# EAGLE schematic OEPS_V2 (EAGLE 9.5.2)
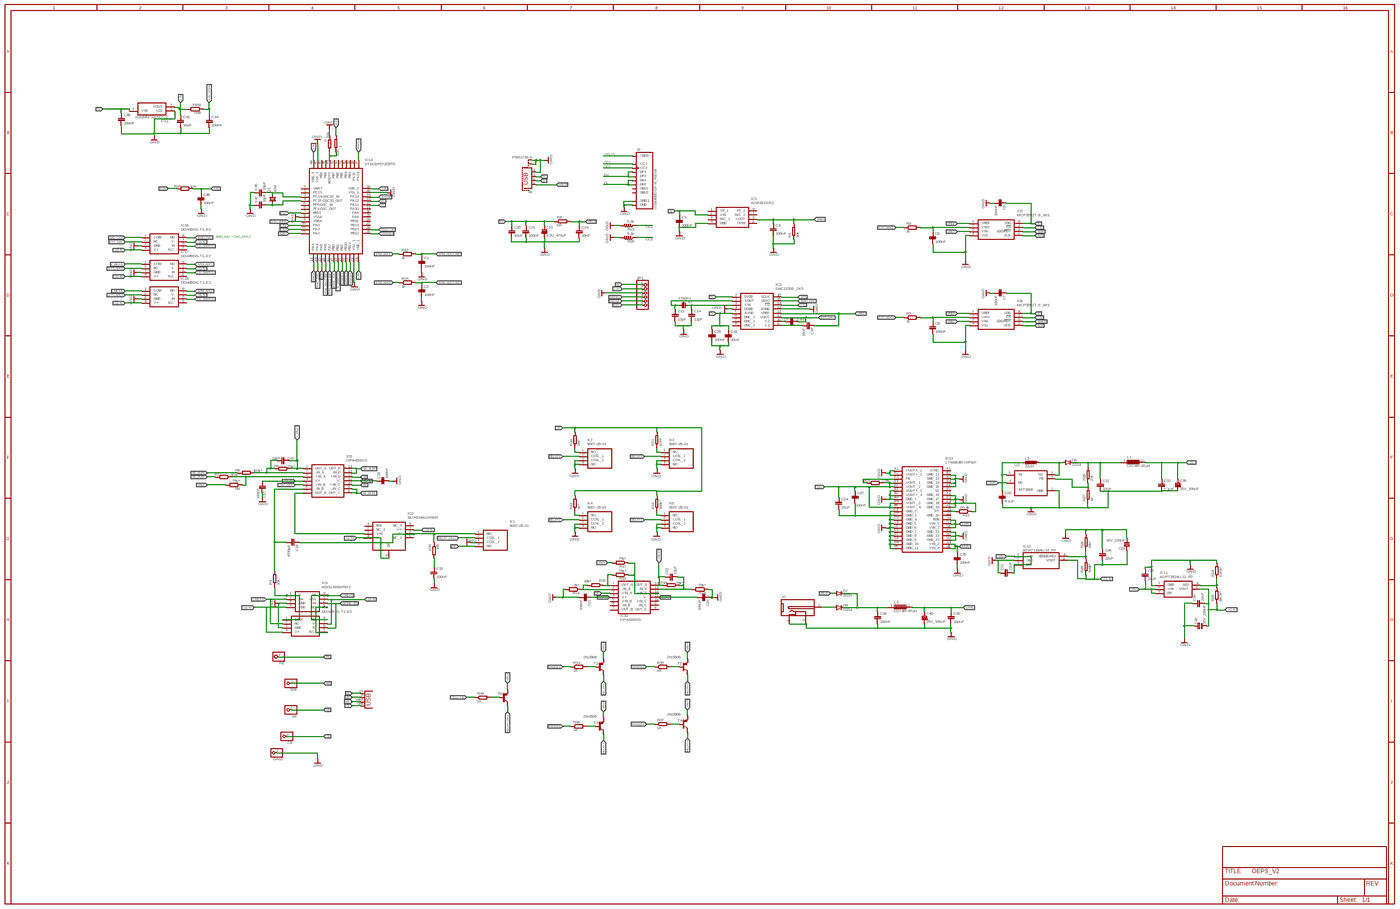
[diagram p0: schematic, sheet 1, overview]
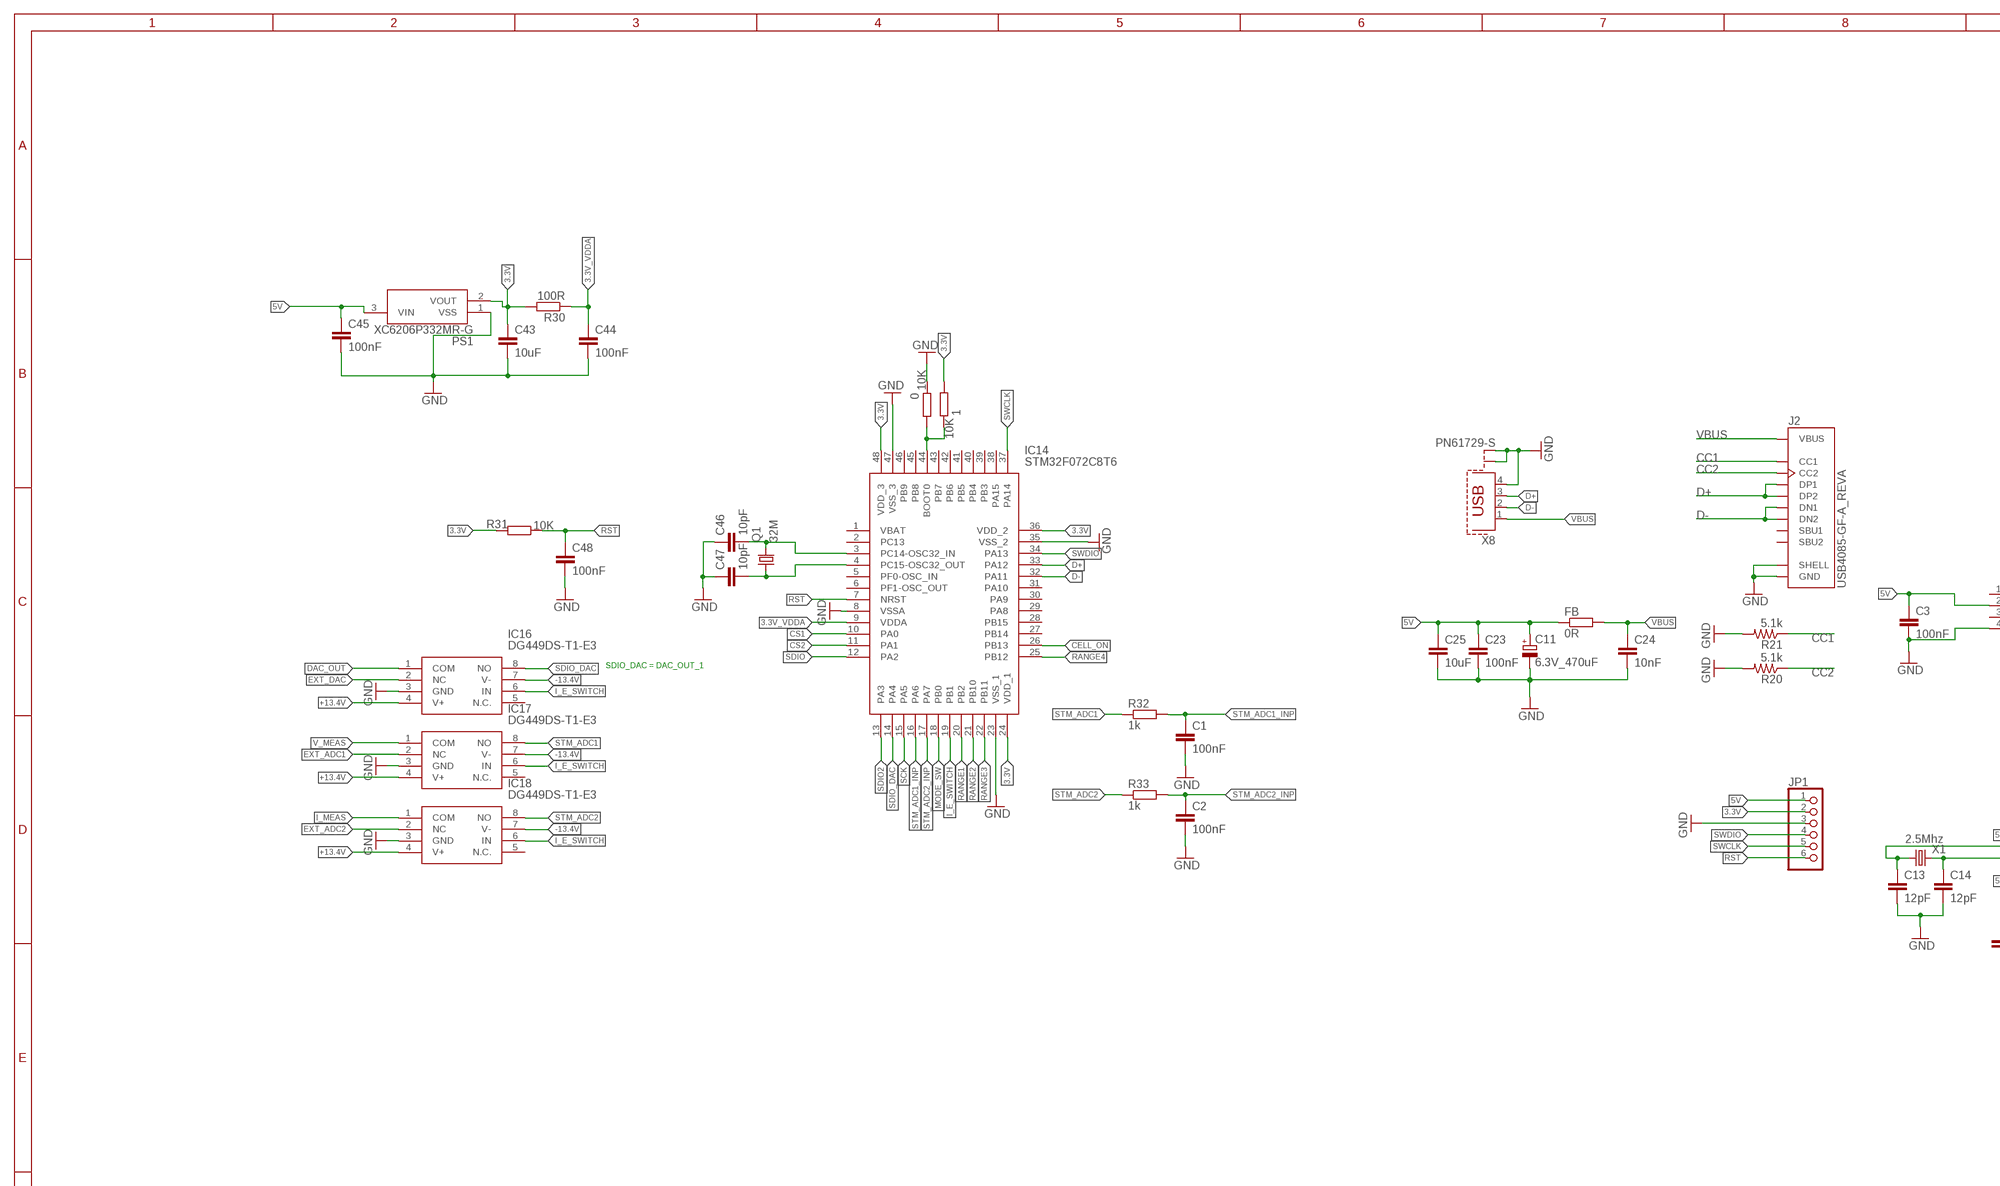
[diagram p1: schematic, sheet 1, part 1 of 4]
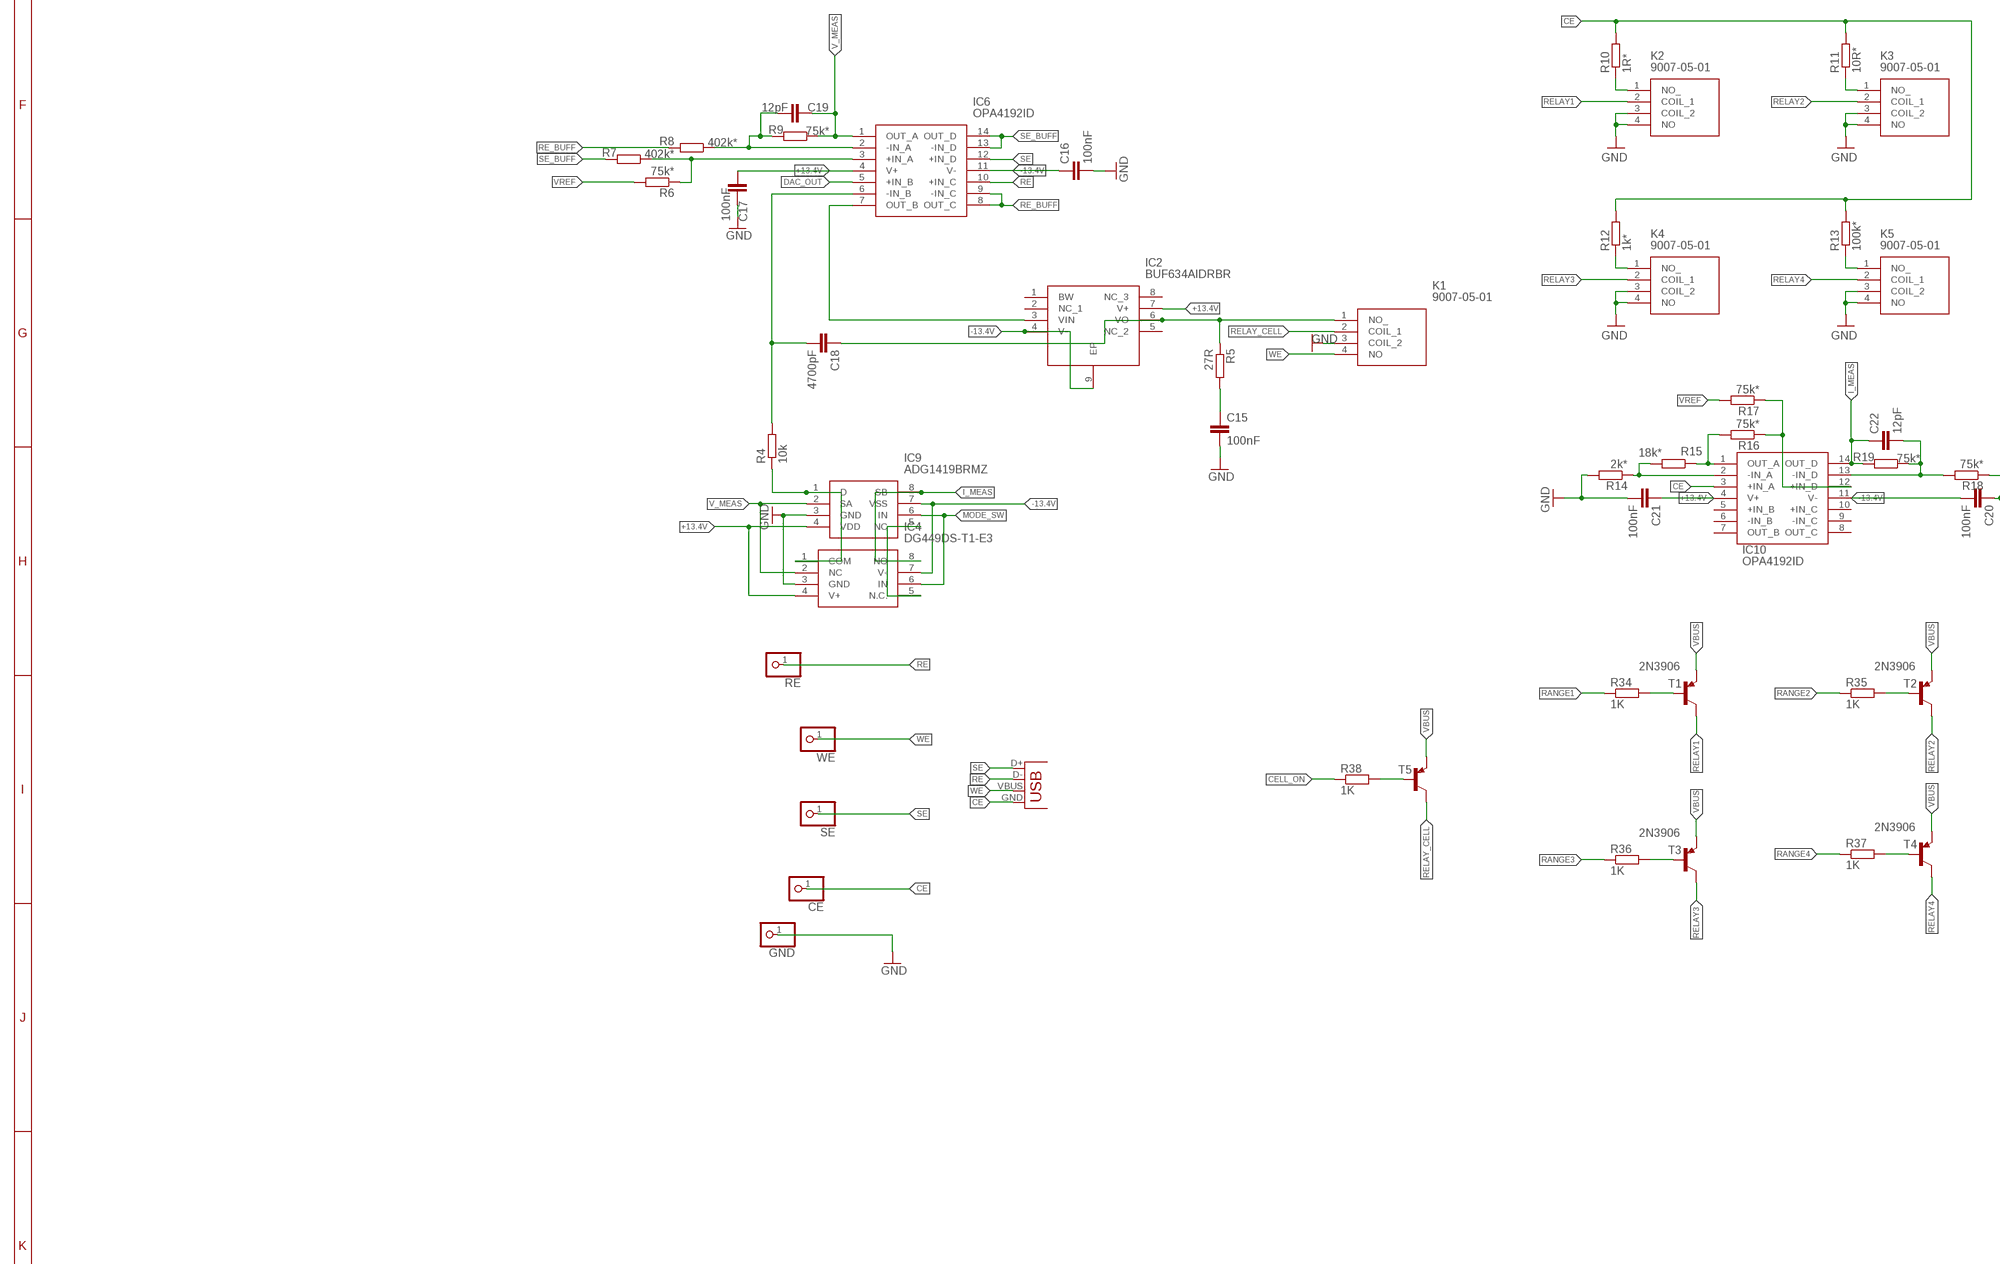
[diagram p2: schematic, sheet 1, part 2 of 4]
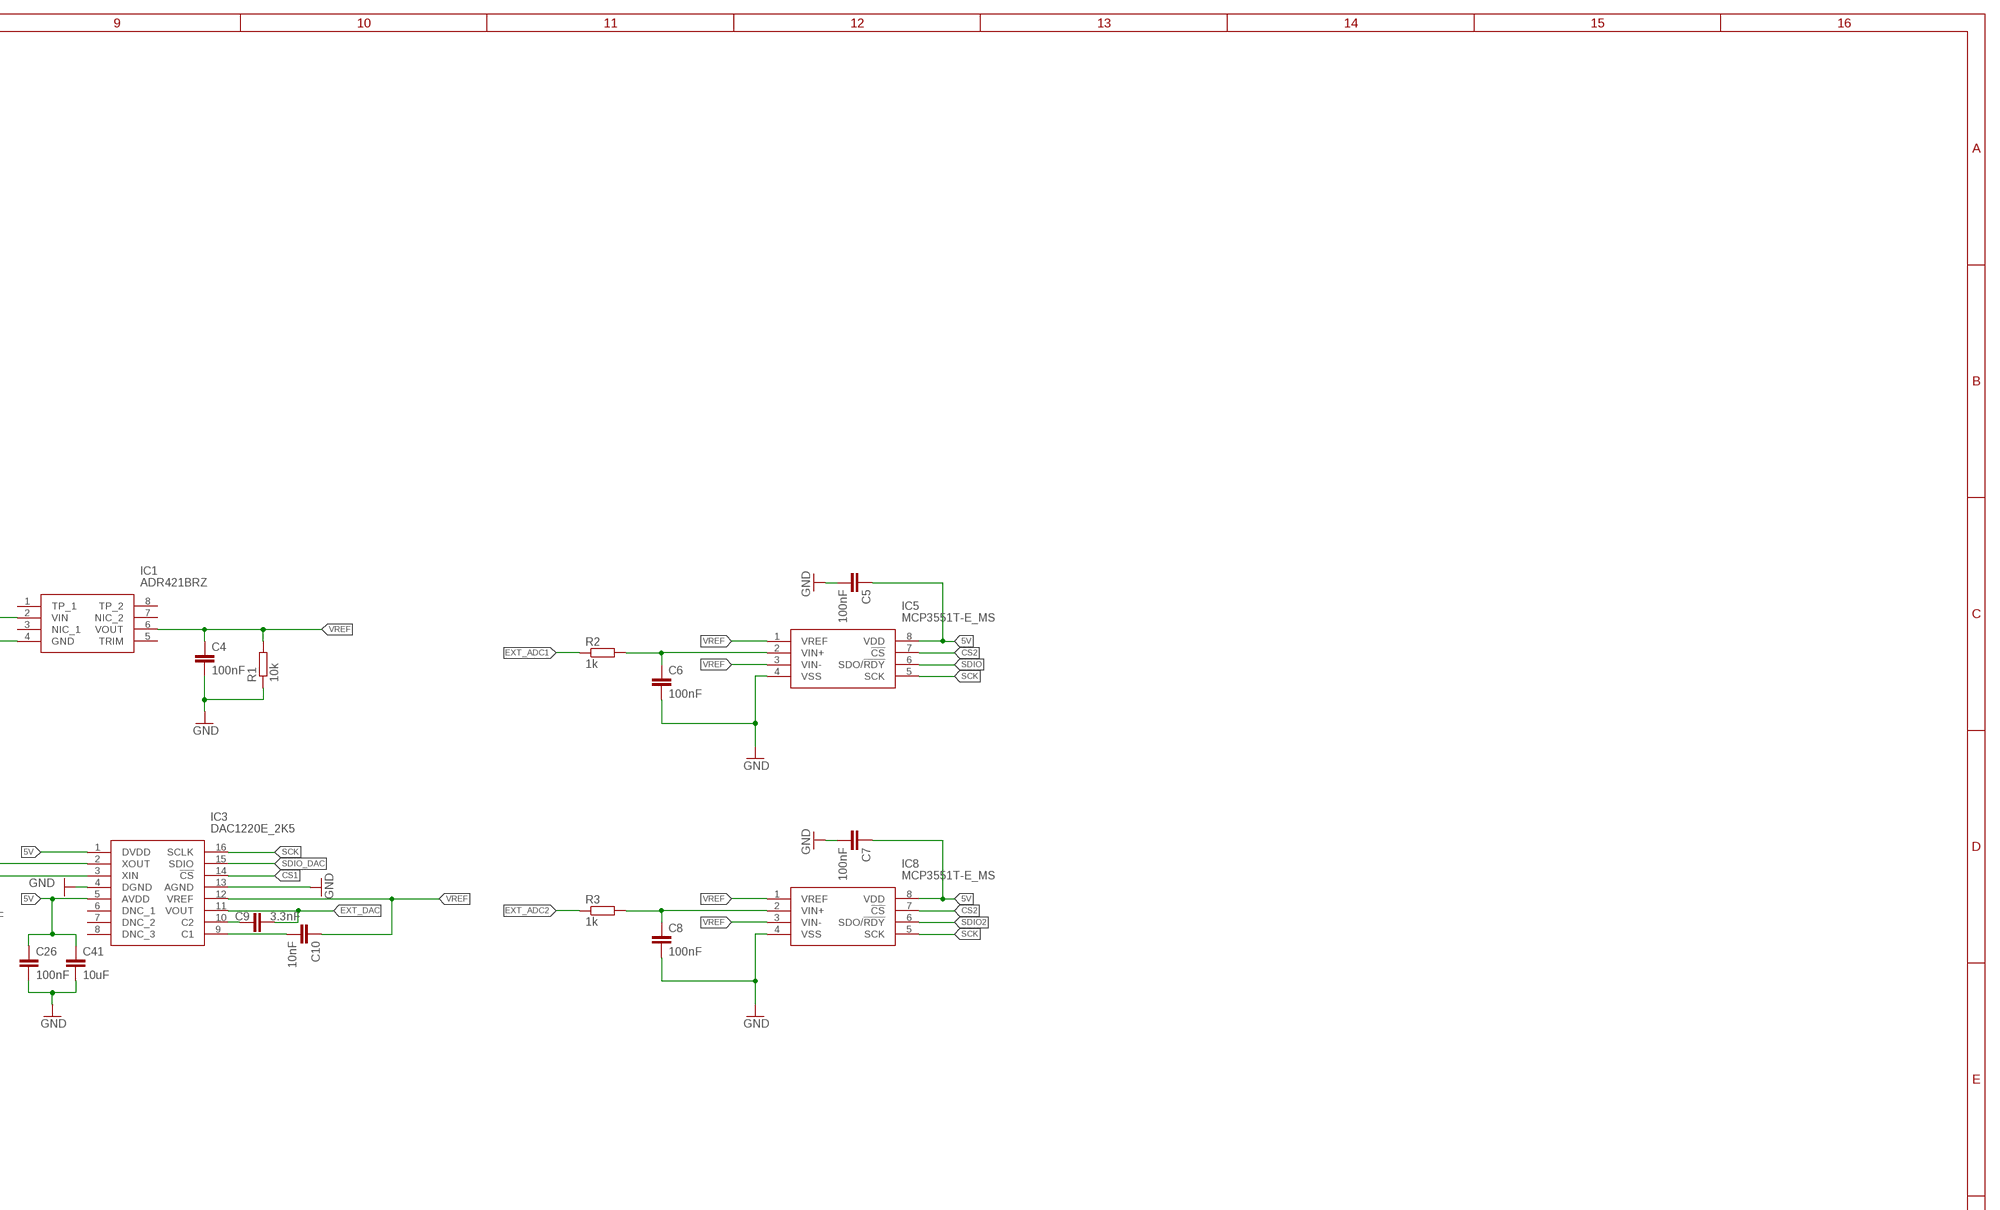
[diagram p3: schematic, sheet 1, part 3 of 4]
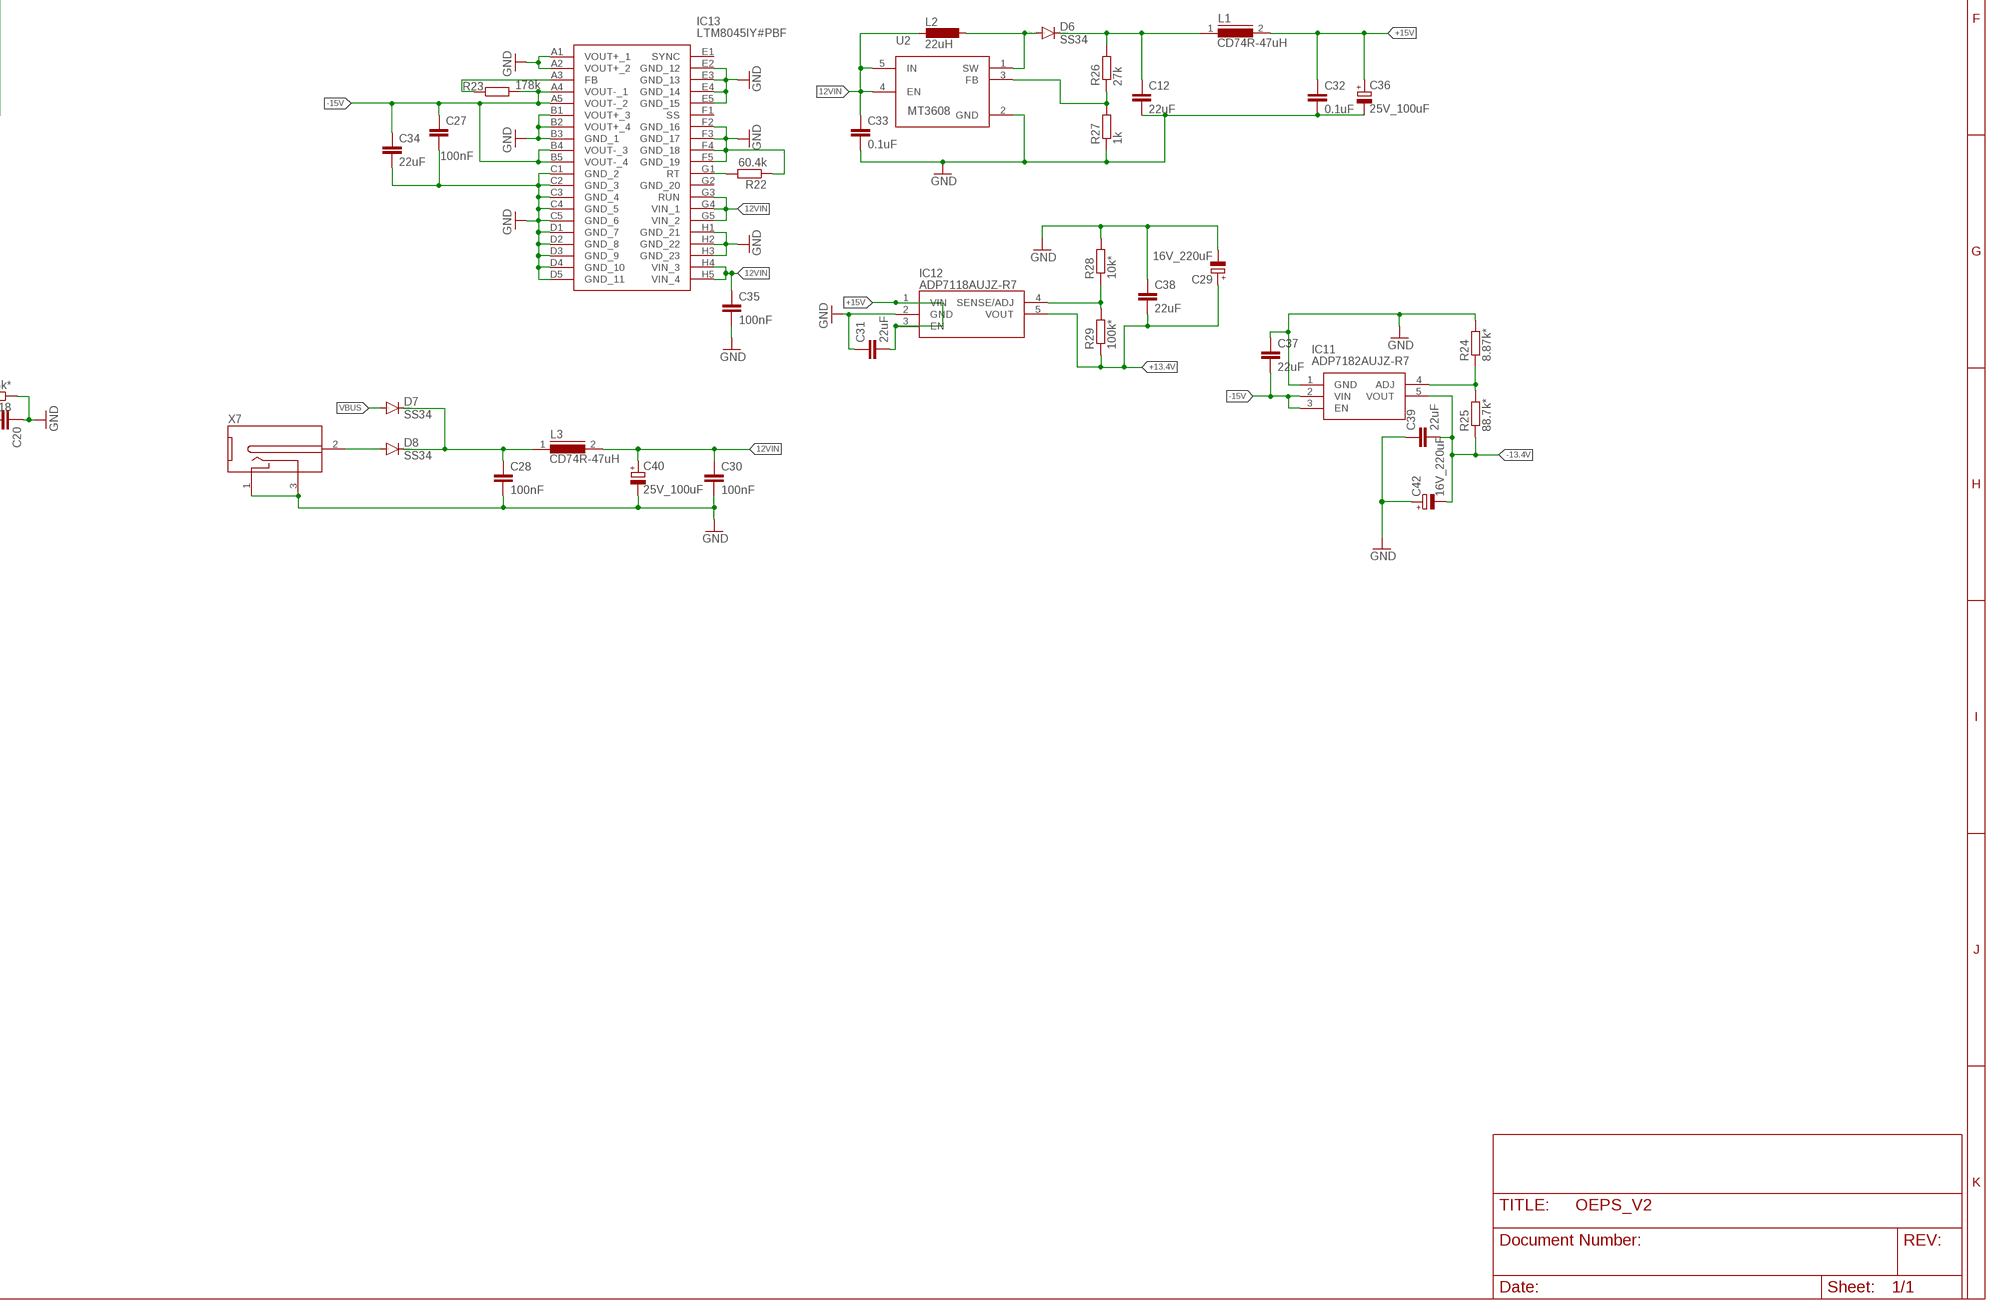
[diagram p4: schematic, sheet 1, part 4 of 4]

## Parts
0  10K  R-EU_R0603  [R0603]
1  10K  R-EU_R0603  [R0603]
C1  100nF  C-EUC0603  [C0603]
C2  100nF  C-EUC0603  [C0603]
C3  100nF  C-EUC0603  [C0603]
C4  100nF  C-EUC0603  [C0603]
C5  100nF  C-EUC0603  [C0603]
C6  100nF  C-EUC0603  [C0603]
C7  100nF  C-EUC0603  [C0603]
C8  100nF  C-EUC0603  [C0603]
C9  3.3nF  C-EUC0603  [C0603]
C10  10nF  C-EUC0603  [C0603]
C11  6.3V_470uF  CPOL-EU153CLV-0605  [153CLV-0605]
C12  22uF  C-EUC1206  [C1206]
C13  12pF  C-EUC0603  [C0603]
C14  12pF  C-EUC0603  [C0603]
C15  100nF  C-EUC0603  [C0603]
C16  100nF  C-EUC0603  [C0603]
C17  100nF  C-EUC0603  [C0603]
C18  4700pF  C-EUC0603  [C0603]
C19  12pF  C-EUC0603  [C0603]
C20  100nF  C-EUC0603  [C0603]
C21  100nF  C-EUC0603  [C0603]
C22  12pF  C-EUC0603  [C0603]
C23  100nF  C-EUC0603  [C0603]
C24  10nF  C-EUC0603  [C0603]
C25  10uF  C-EUC0603  [C0603]
C26  100nF  C-EUC0603  [C0603]
C27  100nF  C-EUC0805  [C0805]
C28  100nF  C-EUC0805  [C0805]
C29  16V_220uF  CPOL-EU153CLV-0605  [153CLV-0605]
C30  100nF  C-EUC0805  [C0805]
C31  22uF  C-EUC1206  [C1206]
C32  0.1uF  C-EUC0805  [C0805]
C33  0.1uF  C-EUC0805  [C0805]
C34  22uF  C-EUC1206  [C1206]
C35  100nF  C-EUC0805  [C0805]
C36  25V_100uF  CPOL-EU153CLV-0605  [153CLV-0605]
C37  22uF  C-EUC1206  [C1206]
C38  22uF  C-EUC1206  [C1206]
C39  22uF  C-EUC1206  [C1206]
C40  25V_100uF  CPOL-EU153CLV-0605  [153CLV-0605]
C41  10uF  C-EUC0603  [C0603]
C42  16V_220uF  CPOL-EU153CLV-0605  [153CLV-0605]
C43  10uF  C-EUC0603  [C0603]
C44  100nF  C-EUC0603  [C0603]
C45  100nF  C-EUC0603  [C0603]
C46  10pF  C-EUC0603  [C0603]
C47  10pF  C-EUC0603  [C0603]
C48  100nF  C-EUC0603  [C0603]
CE  PINHD-1X1  [1X01]
D6  SS34  DIODE-DO-214AC  [DO-214AC]
D7  SS34  DIODE-DO-214AC  [DO-214AC]
D8  SS34  DIODE-DO-214AC  [DO-214AC]
FB  0R  R-EU_R0805  [R0805]
GND  PINHD-1X1  [1X01]
IC1  ADR421BRZ  [SOIC127P600X175-8N]
IC2  BUF634AIDRBR  [SON65P300X300X100-9N]
IC3  DAC1220E_2K5  [SOP64P600X175-16N]
IC4  DG449DS-T1-E3  [SOP65P280X145-8N]
IC5  MCP3551T-E_MS  [SOP65P490X110-8N@1]
IC6  OPA4192ID  [SOIC127P600X175-14N]
IC8  MCP3551T-E_MS  [SOP65P490X110-8N@1]
IC9  ADG1419BRMZ  [SOP65P490X110-8N]
IC10  OPA4192ID  [SOIC127P600X175-14N]
IC11  ADP7182AUJZ-R7  [SOT95P280X100-5N]
IC12  ADP7118AUJZ-R7  [SOT95P280X100-5N]
IC13  LTM8045IY#PBF  [BGA40C127P5X8_625X1125X512]
IC14  STM32F072C8T6  [QFP50P900X900X160-48N]
IC16  DG449DS-T1-E3  [SOP65P280X145-8N]
IC17  DG449DS-T1-E3  [SOP65P280X145-8N]
IC18  DG449DS-T1-E3  [SOP65P280X145-8N]
J2  USB4085-GF-A_REVA  [GCT_USB4085-GF-A_REVA]
JP1  PINHD-1X6  [1X06]
K1  9007-05-01  [90070501]
K2  9007-05-01  [90070501]
K3  9007-05-01  [90070501]
K4  9007-05-01  [90070501]
K5  9007-05-01  [90070501]
L1  CD74R-47uH  DR74  [DR74]
L2  22uH  L-EUPIS2816  [PIS2816]
L3  CD74R-47uH  DR74  [DR74]
PS1  XC6206P332MR-G  [SOT95P280X130-3N]
Q1  32M  KX-7  [3.2X2.5_KX-7]
R1  10k  R-EU_R0603  [R0603]
R2  1k  R-EU_R0603  [R0603]
R3  1k  R-EU_R0603  [R0603]
R4  10k  R-EU_R0603  [R0603]
R5  27R  R-EU_R0603  [R0603]
R6  75k*  R-EU_R0603  [R0603]
R7  402k*  R-EU_R0603  [R0603]
R8  402k*  R-EU_R0603  [R0603]
R9  75k*  R-EU_R0603  [R0603]
R10  1R*  R-EU_R0805  [R0805]
R11  10R*  R-EU_R0805  [R0805]
R12  1k*  R-EU_R0805  [R0805]
R13  100k*  R-EU_R0805  [R0805]
R14  2k*  R-EU_R0603  [R0603]
R15  18k*  R-EU_R0603  [R0603]
R16  75k*  R-EU_R0603  [R0603]
R17  75k*  R-EU_R0603  [R0603]
R18  75k*  R-EU_R0603  [R0603]
R19  75k*  R-EU_R0603  [R0603]
R20  5.1k  R-US_R0603  [R0603]
R21  5.1k  R-US_R0603  [R0603]
R22  60.4k  R-EU_R0603  [R0603]
R23  178k  R-EU_R0603  [R0603]
R24  8.87k*  R-EU_R0603  [R0603]
R25  88.7k*  R-EU_R0603  [R0603]
R26  27k  R-EU_R0603  [R0603]
R27  1k  R-EU_R0603  [R0603]
R28  10k*  R-EU_R0603  [R0603]
R29  100k*  R-EU_R0603  [R0603]
R30  100R  R-EU_R0603  [R0603]
R31  10K  R-EU_R0603  [R0603]
R32  1k  R-EU_R0603  [R0603]
R33  1k  R-EU_R0603  [R0603]
R34  1K  R-EU_R0603  [R0603]
R35  1K  R-EU_R0603  [R0603]
R36  1K  R-EU_R0603  [R0603]
R37  1K  R-EU_R0603  [R0603]
R38  1K  R-EU_R0603  [R0603]
RE  PINHD-1X1  [1X01]
SE  PINHD-1X1  [1X01]
T1  2N3906  MMBT3906LT1-PNP-SOT23-BEC  [SOT23-BEC]
T2  2N3906  MMBT3906LT1-PNP-SOT23-BEC  [SOT23-BEC]
T3  2N3906  MMBT3906LT1-PNP-SOT23-BEC  [SOT23-BEC]
T4  2N3906  MMBT3906LT1-PNP-SOT23-BEC  [SOT23-BEC]
T5  MMBT3906LT1-PNP-SOT23-BEC  [SOT23-BEC]
U2  MT3608  [SOT95P280X145-6N]
WE  PINHD-1X1  [1X01]
X1  2.5Mhz  CRYSTALS-NOGND-HC49  [HC49]
X6  USB-A-H  [USB-A-H]
X7  DC-2.1MM-5MM  [DC-21MM]
X8  PN61729-S  [PN61729-S]

## Nets
3.3V: 1.2 C43.1 IC14.24(VDD_1) IC14.36(VDD_2) IC14.48(VDD_3) JP1.2 PS1.2(VOUT) R30.2 R31.2
3.3V_VDDA: C44.1 IC14.9(VDDA) R30.1
5V: C3.1 C5.1 C7.1 C11.+ C23.1 C25.1 C26.1 C41.1 C45.1 FB.1 IC1.2(VIN) IC3.1(DVDD) IC3.5(AVDD) IC5.8(VDD) IC8.8(VDD) JP1.1 PS1.3(VIN)
12VIN: C30.1 C33.1 C35.1 C40.+ IC13.G3(RUN) IC13.G4(VIN_1) IC13.G5(VIN_2) IC13.H4(VIN_3) IC13.H5(VIN_4) L2.2 L3.2 U2.4(EN) U2.5(IN)
+13.4V: C17.2 C21.1 C29.+ C38.2 IC2.7(V+) IC4.4(V+) IC6.4(V+) IC9.4(VDD) IC10.4(V+) IC12.5(VOUT) IC16.4(V+) IC17.4(V+) IC18.4(V+) R29.1
+15V: C31.2 C32.1 C36.+ IC12.1(VIN) IC12.3(EN) L1.2
-13.4V: C16.1 C20.1 C39.2 C42.- IC2.4(V-) IC2.9(EP) IC4.7(V-) IC6.11(V-) IC9.7(VSS) IC10.11(V-) IC11.5(VOUT) IC16.7(V-) IC17.7(V-) IC18.7(V-) R25.1
-15V: C27.1 C34.1 C37.2 IC11.2(VIN) IC11.3(EN) IC13.A4(VOUT-_1) IC13.A5(VOUT-_2) IC13.B4(VOUT-_3) IC13.B5(VOUT-_4) R23.2
CC1: J2.A5(CC1) R21.1
CC2: J2.B5(CC2) R20.1
CE: CE.1 IC10.3(+IN_A) R10.2 R11.2 R12.2 R13.2 X6.GND
CELL_ON: IC14.26(PB13) R38.1
CS1: IC3.14(!CS) IC14.10(PA0)
CS2: IC5.7(!CS) IC8.7(!CS) IC14.11(PA1)
D+: IC14.33(PA12) J2.A6(DP1) J2.B6(DP2) X8.3
D-: IC14.32(PA11) J2.A7(DN1) J2.B7(DN2) X8.2
DAC_OUT: IC6.5(+IN_B) IC16.1(COM)
EXT_ADC1: IC17.2(NC) R2.1
EXT_ADC2: IC18.2(NC) R3.1
EXT_DAC: C9.1 IC3.11(VOUT) IC16.2(NC)
GND: 0.1 C1.2 C2.2 C3.2 C4.2 C5.2 C6.2 C7.2 C8.2 C11.- C12.2 C13.2 C14.2 C15.2 C16.2 C17.1 C20.2 C21.2 C23.2 C24.2 C25.2 C26.2 C27.2 C28.2 C29.- C30.2 C31.1 C32.2 C33.2 C34.2 C35.2 C36.- C37.1 C38.1 C39.1 C40.- C41.2 C42.+ C43.2 C44.2 C45.2 C46.1 C47.1 C48.2 GND.1 IC1.4(GND) IC3.4(DGND) IC3.13(AGND) IC4.3(GND) IC5.4(VSS) IC8.4(VSS) IC9.3(GND) IC11.1(GND) IC12.2(GND) IC13.A1(VOUT+_1) IC13.A2(VOUT+_2) IC13.B1(VOUT+_3) IC13.B2(VOUT+_4) IC13.B3(GND_1) IC13.C1(GND_2) IC13.C2(GND_3) IC13.C3(GND_4) IC13.C4(GND_5) IC13.C5(GND_6) IC13.D1(GND_7) IC13.D2(GND_8) IC13.D3(GND_9) IC13.D4(GND_10) IC13.D5(GND_11) IC13.E2(GND_12) IC13.E3(GND_13) IC13.E4(GND_14) IC13.E5(GND_15) IC13.F2(GND_16) IC13.F3(GND_17) IC13.F4(GND_18) IC13.F5(GND_19) IC13.H1(GND_21) IC13.H2(GND_22) IC13.H3(GND_23) IC14.8(VSSA) IC14.23(VSS_1) IC14.35(VSS_2) IC14.47(VSS_3) IC16.3(GND) IC17.3(GND) IC18.3(GND) J2.A1(GND) J2.A12(GND) J2.B1(GND) J2.B12(GND) J2.P1(SHELL) J2.P2(SHELL) J2.P3(SHELL) J2.P4(SHELL) JP1.3 K1.3(COIL_2) K2.3(COIL_2) K2.4(NO) K3.3(COIL_2) K3.4(NO) K4.3(COIL_2) K4.4(NO) K5.3(COIL_2) K5.4(NO) PS1.1(VSS) R1.1 R14.2 R18.1 R20.2 R21.2 R22.1 R24.2 R27.1 R28.2 U2.2(GND) X7.1 X7.3 X8.4 X8.S1 X8.S2
I_E_SWITCH: IC14.19(PB1) IC16.6(IN) IC17.6(IN) IC18.6(IN)
I_MEAS: C22.1 IC4.8(NO) IC9.8(SB) IC10.14(OUT_D) IC18.1(COM) R19.2
MODE_SW: IC4.6(IN) IC9.6(IN) IC14.18(PB0)
N$1: C6.1 IC5.2(VIN+) R2.2
N$2: C8.1 IC8.2(VIN+) R3.2
N$3: R34.2 T1.B
N$4: C46.2 IC14.3(PC14-OSC32_IN) Q1.3
N$5: C14.1 IC3.3(XIN) X1.2
N$6: C13.1 IC3.2(XOUT) X1.1
N$7: C9.2 IC3.10(C2)
N$8: C10.2 IC3.9(C1)
N$9: IC4.1(COM) IC9.1(D) R4.1
N$10: C18.2 IC6.6(-IN_B) R4.2
N$11: IC2.3(VIN) IC6.7(OUT_B)
N$12: C18.1 IC2.6(VO) K1.1(NO_) R5.1
N$13: C15.1 R5.2
N$14: IC4.5(N.C.) IC9.5(NC)
N$15: IC6.3(+IN_A) R6.1 R7.1
N$16: C19.2 IC6.2(-IN_A) R8.1 R9.2
N$17: K2.1(NO_) R10.1
N$18: IC10.1(OUT_A) R15.1 R16.2
N$19: K3.1(NO_) R11.1
N$20: IC10.2(-IN_A) R14.1 R15.2
N$21: K4.1(NO_) R12.1
N$22: C12.1 D6.C L1.1 R26.2
N$23: K5.1(NO_) R13.1
N$24: IC10.12(+IN_D) R16.1 R17.1
N$25: C28.1 D7.C D8.C L3.1
N$26: C22.2 IC10.13(-IN_D) R18.2 R19.1
N$27: IC11.4(ADJ) R24.1 R25.2
N$28: D8.A X7.2
N$29: IC12.4(SENSE/ADJ) R28.1 R29.2
N$30: C47.2 IC14.4(PC15-OSC32_OUT) Q1.1
N$31: 0.2 1.1 IC14.44(BOOT0)
N$32: R35.2 T2.B
N$33: IC13.G1(RT) R22.2
N$34: IC13.A3(FB) R23.1
N$35: R36.2 T3.B
N$36: R37.2 T4.B
N$37: R38.2 T5.B
N$38: D6.A L2.1 U2.1(SW)
N$39: R26.1 R27.2 U2.3(FB)
RANGE1: IC14.20(PB2) R34.1
RANGE2: IC14.21(PB10) R35.1
RANGE3: IC14.22(PB11) R36.1
RANGE4: IC14.25(PB12) R37.1
RE: IC6.10(+IN_C) RE.1 X6.D-
RE_BUFF: IC6.8(OUT_C) IC6.9(-IN_C) R8.2
RELAY1: K2.2(COIL_1) T1.C
RELAY2: K3.2(COIL_1) T2.C
RELAY3: K4.2(COIL_1) T3.C
RELAY4: K5.2(COIL_1) T4.C
RELAY_CELL: K1.2(COIL_1) T5.C
RST: C48.1 IC14.7(NRST) JP1.6 R31.1
SCK: IC3.16(SCLK) IC5.5(SCK) IC8.5(SCK) IC14.15(PA5)
SDIO: IC5.6(SDO/!RDY) IC14.12(PA2)
SDIO2: IC8.6(SDO/!RDY) IC14.13(PA3)
SDIO_DAC: IC3.15(SDIO) IC14.14(PA4) IC16.8(NO)
SE: IC6.12(+IN_D) SE.1 X6.D+
SE_BUFF: IC6.13(-IN_D) IC6.14(OUT_D) R7.2
STM_ADC1: IC17.8(NO) R32.1
STM_ADC1_INP: C1.1 IC14.16(PA6) R32.2
STM_ADC2: IC18.8(NO) R33.1
STM_ADC2_INP: C2.1 IC14.17(PA7) R33.2
SWCLK: IC14.37(PA14) JP1.5
SWDIO: IC14.34(PA13) JP1.4
V_MEAS: C19.1 IC4.2(NC) IC6.1(OUT_A) IC9.2(SA) IC17.1(COM) R9.1
VBUS: C24.1 D7.A FB.2 J2.A4(VBUS) J2.A9(VBUS) J2.B4(VBUS) J2.B9(VBUS) T1.E T2.E T3.E T4.E T5.E X8.1
VREF: C4.1 C10.1 IC1.6(VOUT) IC3.12(VREF) IC5.1(VREF) IC5.3(VIN-) IC8.1(VREF) IC8.3(VIN-) R1.2 R6.2 R17.2
WE: K1.4(NO) WE.1 X6.VBUS
Unconnected: IC1.1(TP_1) IC1.3(NIC_1) IC1.5(TRIM) IC1.7(NIC_2) IC1.8(TP_2) IC2.1(BW) IC2.2(NC_1) IC2.5(NC_2) IC2.8(NC_3) IC3.6(DNC_1) IC3.7(DNC_2) IC3.8(DNC_3) IC10.5(+IN_B) IC10.6(-IN_B) IC10.7(OUT_B) IC10.8(OUT_C) IC10.9(-IN_C) IC10.10(+IN_C) IC13.E1(SYNC) IC13.F1(SS) IC13.G2(GND_20) IC14.2(PC13) IC14.5(PF0-OSC_IN) IC14.6(PF1-OSC_OUT) IC14.27(PB14) IC14.28(PB15) IC14.29(PA8) IC14.30(PA9) IC14.31(PA10) IC14.38(PA15) IC14.39(PB3) IC14.40(PB4) IC14.41(PB5) IC14.42(PB6) IC14.43(PB7) IC14.45(PB8) IC14.46(PB9) IC16.5(N.C.) IC17.5(N.C.) IC18.5(N.C.) J2.A8(SBU1) J2.B8(SBU2)

## Notes on the sheet
- SDIO_DAC = DAC_OUT_1

## Power pins joined to a net without a drawn wire
VBAT: IC14.1(VBAT)

## Library data of the parts
0 1 FB R1-R19 R22-R38 = rcl:R-EU_: RESISTOR, European symbol; SPICEPREFIX: R
C1-C10 C12-C28 C30-C35 C37-C39 C41 C43-C48 = rcl:C-EU: CAPACITOR, European symbol; SPICEPREFIX: C
C11 C29 C36 C40 C42 = rcl:CPOL-EU: POLARIZED CAPACITOR, European symbol; SPICEPREFIX: C
CE GND RE SE WE = pinhead:PINHD-1X1: PIN HEADER
D6-D8 = diode:DIODE-: DIODE
IC1 = SamacSys_Parts:ADR421BRZ: Ultraprecision, Low Noise, 2.048 V/2.500 V/ 3.00 V/5.00 V XFET Voltage References Source: Datasheet <https://datasheet.datasheetarchive.com/originals/distributors/Datasheets-4/DSA-69794.pdf>; DESCRIPTION: Ultraprecision, Low Noise, 2.048 V/2.500 V/ 3.00 V/5.00 V XFET Voltage References; HEIGHT: 1.75mm; MANUFACTURER_NAME: Analog Devices; MANUFACTURER_PART_NUMBER: ADR421BRZ; MOUSER_PART_NUMBER: 584-ADR421BRZ; MOUSER_PRICE-STOCK: https://www.mouser.co.uk/ProductDetail/Analog-Devices/ADR421BRZ?qs=WIvQP4zGangobVBJm065VA%3D%3D
IC2 = SamacSys_Parts:BUF634AIDRBR: High Speed Operational Amplifiers 210-MHz, 250-mA high-speed buffer 8-SON -40 to 125 Source: Datasheet <https://www.ti.com/lit/gpn/BUF634A>; DESCRIPTION: High Speed Operational Amplifiers 210-MHz, 250-mA high-speed buffer 8-SON -40 to 125; HEIGHT: 1mm; MANUFACTURER_NAME: Texas Instruments; MANUFACTURER_PART_NUMBER: BUF634AIDRBR; MOUSER_PART_NUMBER: 595-BUF634AIDRBR; MOUSER_PRICE-STOCK: https://www.mouser.co.uk/ProductDetail/Texas-Instruments/BUF634AIDRBR?qs=KUoIvG%2F9IlYvIKryrUbyQQ%3D%3D
IC3 = SamacSys_Parts:DAC1220E_2K5: 20-Bit Delta-Sigma Low Power Digital-To-Analog Converter Source: Datasheet <http://www.ti.com/lit/gpn/DAC1220>; DESCRIPTION: 20-Bit Delta-Sigma Low Power Digital-To-Analog Converter; HEIGHT: 1.75mm; MANUFACTURER_NAME: Texas Instruments; MANUFACTURER_PART_NUMBER: DAC1220E/2K5; MOUSER_PART_NUMBER: 595-DAC1220E/2K5; MOUSER_PRICE-STOCK: https://www.mouser.co.uk/ProductDetail/Texas-Instruments/DAC1220E-2K5?qs=vul0MlC%2Fa1fUrM47cnUdGQ%3D%3D
IC4 IC16-IC18 = SamacSys_Parts:DG449DS-T1-E3: VISHAY - DG449DS-T1-E3 - SWITCH, HIGH VOLT, SINGLE, SPDT, 449 Source: Datasheet <https://www.vishay.com/docs/73897/dg449.pdf>; DESCRIPTION: VISHAY - DG449DS-T1-E3 - SWITCH, HIGH VOLT, SINGLE, SPDT, 449; HEIGHT: 1.45mm; MANUFACTURER_NAME: Vishay; MANUFACTURER_PART_NUMBER: DG449DS-T1-E3; MOUSER_PART_NUMBER: 781-DG449DS-E3; MOUSER_PRICE-STOCK: https://www.mouser.co.uk/ProductDetail/Vishay-Siliconix/DG449DS-T1-E3?qs=G1LhLIAbs1xMaNhvKfAYLQ%3D%3D
IC5 IC8 = SamacSys_Parts:MCP3551T-E_MS: Analog to Digital Converters - ADC 22-bit ADC Source: Datasheet <http://www.microchip.com/mymicrochip/filehandler.aspx?ddocname=en024716>; DESCRIPTION: Analog to Digital Converters - ADC 22-bit ADC; HEIGHT: 1.1mm; MANUFACTURER_NAME: Microchip; MANUFACTURER_PART_NUMBER: MCP3551T-E/MS; MOUSER_PART_NUMBER: 579-MCP3551T-E/MS; MOUSER_PRICE-STOCK: https://www.mouser.co.uk/ProductDetail/Microchip-Technology/MCP3551T-E-MS?qs=usxtMOJb1Rxi73ZB76uH8A%3D%3D
IC6 IC10 = SamacSys_Parts:OPA4192ID: Low-Noise, Low Quiescent Current, 36V RRI/O Precision Op Amps, E-Trim™ Series Source: Datasheet <http://www.ti.com/lit/gpn/opa4192>; DESCRIPTION: Low-Noise, Low Quiescent Current, 36V RRI/O Precision Op Amps, E-Trim&#153; Series; HEIGHT: 1.75mm; MANUFACTURER_NAME: Texas Instruments; MANUFACTURER_PART_NUMBER: OPA4192ID; MOUSER_PART_NUMBER: 595-OPA4192ID; MOUSER_PRICE-STOCK: https://www.mouser.co.uk/ProductDetail/Texas-Instruments/OPA4192ID?qs=yajEpaT76uTqzJuNHgvcqA%3D%3D
IC9 = SamacSys_Parts:ADG1419BRMZ: Analog Devices ADG1419BRMZ, Analogue Switch Single SPDT, 12 V, 8-Pin MSOP Source: Datasheet; DESCRIPTION: Analog Devices ADG1419BRMZ, Analogue Switch Single SPDT, 12 V, 8-Pin MSOP; HEIGHT: 1.1mm; MANUFACTURER_NAME: Analog Devices; MANUFACTURER_PART_NUMBER: ADG1419BRMZ; MOUSER_PART_NUMBER: 584-ADG1419BRMZ; MOUSER_PRICE-STOCK: https://www.mouser.co.uk/ProductDetail/Analog-Devices/ADG1419BRMZ?qs=BpaRKvA4VqGzwbG8HQZqgQ%3D%3D
IC11 = SamacSys_Parts:ADP7182AUJZ-R7: Analog Devices ADP7182AUJZ-R7, LDO Regulator, -200mA Adjustable, -1.2 -28 V, +/-1% 5-Pin, TSOT Source: Datasheet <http://www.analog.com/media/en/technical-documentation/data-sheets/ADP7182.pdf>; DESCRIPTION: Analog Devices ADP7182AUJZ-R7, LDO Regulator, -200mA Adjustable, -1.2 -28 V, +/-1% 5-Pin, TSOT; HEIGHT: 1mm; MANUFACTURER_NAME: Analog Devices; MANUFACTURER_PART_NUMBER: ADP7182AUJZ-R7; MOUSER_PART_NUMBER: 584-ADP7182AUJZ-R7; MOUSER_PRICE-STOCK: https://www.mouser.co.uk/ProductDetail/Analog-Devices/ADP7182AUJZ-R7?qs=J50fqX%2Fl9ipEM%252BbQxVSVcg%3D%3D
IC12 = SamacSys_Parts:ADP7118AUJZ-R7: ANALOG DEVICES - ADP7118AUJZ-R7 - LDO, ADJ, 1.2V TO 19V, 0.2A, TSOT-5 Source: Datasheet <https://componentsearchengine.com/Datasheets/1/ADP7118AUJZ-R7.pdf>; DESCRIPTION: ANALOG DEVICES - ADP7118AUJZ-R7 - LDO, ADJ, 1.2V TO 19V, 0.2A, TSOT-5; HEIGHT: 1mm; MANUFACTURER_NAME: Analog Devices; MANUFACTURER_PART_NUMBER: ADP7118AUJZ-R7; MOUSER_PART_NUMBER: 584-ADP7118AUJZ-R7; MOUSER_PRICE-STOCK: https://www.mouser.co.uk/ProductDetail/Analog-Devices/ADP7118AUJZ-R7?qs=hpwIUhX6lWw434nsgJgZWg%3D%3D
IC13 = SamacSys_Parts:LTM8045IY#PBF: Inverting or SEPIC Module DC/DC Converter with Up to 700mA Output Current Source: Datasheet <https://datasheet.datasheetarchive.com/originals/distributors/Datasheets-SFU4/DSASF4000-3563.pdf>; DESCRIPTION: Inverting or SEPIC Module DC/DC Converter with Up to 700mA Output Current; HEIGHT: 5.12mm; MANUFACTURER_NAME: Linear Technology; MANUFACTURER_PART_NUMBER: LTM8045IY#PBF; MOUSER_PART_NUMBER: 584-LTM8045IY#PBF; MOUSER_PRICE-STOCK: https://www.mouser.co.uk/ProductDetail/Analog-Devices-Linear-Technology/LTM8045IYPBF?qs=hVkxg5c3xu%252B2BKlbuVxaCw%3D%3D
IC14 = SamacSys_Parts:STM32F072C8T6: STMICROELECTRONICS - STM32F072C8T6 - MCU, ARM CORTEX-M0, 48MHZ, LQFP-48 Source: Datasheet <https://componentsearchengine.com/Datasheets/2/STM32F072C8T6.pdf>; DESCRIPTION: STMICROELECTRONICS - STM32F072C8T6 - MCU, ARM CORTEX-M0, 48MHZ, LQFP-48; HEIGHT: 1.6mm; MANUFACTURER_NAME: STMicroelectronics; MANUFACTURER_PART_NUMBER: STM32F072C8T6; MOUSER_PART_NUMBER: 511-STM32F072C8T6; MOUSER_PRICE-STOCK: https://www.mouser.co.uk/ProductDetail/STMicroelectronics/STM32F072C8T6?qs=4b8myOmUP%252BsnybMOCvNZeA%3D%3D
J2 = USB4085-GF-A_REVA:USB4085-GF-A_REVA: USB 2.0 Type C Receptacle Dip Type, PCB Top Mount Check prices <https://pricing.snapeda.com/parts/USB4085-GF-A/Global%20Connector%20Technology/view-part?ref=eda>; AVAILABILITY: Warning; DESCRIPTION: USB-C (USB TYPE-C) USB 2.0 Receptacle Connector 24 (16+8 Dummy) Position Through Hole, Right Angle; MF: Global Connector Technology; MP: USB4085-GF-A; PACKAGE: Package; PRICE: None; PURCHASE-URL: https://pricing.snapeda.com/search/part/USB4085-GF-A/?ref=eda
JP1 = pinhead:PINHD-1X6: PIN HEADER
K1-K5 = SamacSys_Parts:9007-05-01: Reed Relays 1FORMA 5V W/DIODE Source: Datasheet <https://componentsearchengine.com/Datasheets/2/9007-05-01.pdf>; DESCRIPTION: Reed Relays 1FORMA 5V W/DIODE; HEIGHT: 8.1mm; MANUFACTURER_NAME: Coto Technology; MANUFACTURER_PART_NUMBER: 9007-05-01; MOUSER_PART_NUMBER: 816-9007-05-01; MOUSER_PRICE-STOCK: https://www.mouser.co.uk/ProductDetail/Coto-Technology/9007-05-01?qs=93uzuGORGqeEb2jSXpLSHQ%3D%3D
L1 L3 = inductors:DR74: High Power Density, High Efficiency, Shielded Inductors Source: coiltronics_dr_series.pdf; SPICEPREFIX: L
L2 = rcl:L-EU: INDUCTOR, European symbol; SPICEPREFIX: L
PS1 = SamacSys_Parts:XC6206P332MR-G: LDO Voltage Regulators Source: Datasheet <https://www.torexsemi.com/file/xc6206/XC6206.pdf>; DESCRIPTION: LDO Voltage Regulators; HEIGHT: 1.3mm; MANUFACTURER_NAME: Torex; MANUFACTURER_PART_NUMBER: XC6206P332MR-G; MOUSER_PART_NUMBER: 865-XC6206P332MR-G; MOUSER_PRICE-STOCK: https://www.mouser.co.uk/ProductDetail/Torex-Semiconductor/XC6206P332MR-G?qs=AsjdqWjXhJ%2FXxNpRY3zZ8g%3D%3D
Q1 = crystal-geyer_V1_0:KX: Quartz Crystals (MHz) SMD: KX - Serie Model Size l/w/h [mm] Frequency Range Frequency Stability Temp. Range [°C] Load Capacitance AECQ 200 availabel Datasheet KX-4 KX-5 KX-6 KX-7 KX-9A KX-9B KX-12A KX-12B KX-13 KX-20 KX-K KX-KS 1.6/1.2/0.3 2.0/1.6/0.45 2.5/2.0/0.55 3.2/2.5/0.8 5.0/3.2/1.0 5.0/3.2/1.1 6.0/3.5/1.1 6.0/3.5/1.0 7.0/5.0 /1.3 11.6/5.5/1.6 12.3/4.5/4.2 12.3/4.5/3.2 24.0 ~ 80.0 MHz 16.0 ~ 80.0 MHz 12.0 ~ 80.0 MHz 8.0 ~ 60.0 MHz 7,68 ~ 300,0 MHz 8,0 ~ 50,0 MHz 8,0 ~ 150,0 MHz 8,0 ~ 50,0 MHz 6,0 ~ 160,0 MHz 3,579 ~ 25,0 MHz 3,579 ~ 70,0 MHz 3,579 ~ 70,0 MHz ±10 … ±50ppm ±10 … ±50ppm ±10 … ±50ppm ±10 … ±50ppm ±10 … ±50ppm ±10 … ±50ppm ±10 … ±50ppm ±10 … ±50ppm ±10 … ±50ppm ±50ppm ±10 … ±50ppm ±10 … ±50ppm (*) -40°C …+85°C (*) -40°C …+125°C (*) -40°C …+125°C (*) -40°C …+125°C (*) -40°C …+105°C (*) -40°C …+105°C (*) -40°C …+125°C (*) -40°C …+105°C (*) -40°C …+105°C (*) -40°C …+105°C (*) -40°C …+85°C (*) -40°C …+85°C 8, 8…16 8, 8…16 10, 8…16 12, 7…20 16, 10…20 16, 10…20 16, 10…20 16, 12…20 16, 12…20 16, 12…20 16, 12…30 16, 12…30 - yes yes yes - - - - - - - - KX-4.pdf <http://www.geyer-electronic.de/uploads/tx_userartikelfrequenz/GEYER-KX-4.pdf> KX-5.pdf <http://www.geyer-electronic.de/uploads/tx_userartikelfrequenz/GEYER-KX-5.pdf> KX-6.pdf <http://www.geyer-electronic.de/uploads/tx_userartikelfrequenz/GEYER-KX-6.pdf> KX-7.pdf <http://www.geyer-electronic.de/uploads/tx_userartikelfrequenz/GEYER-KX-7.pdf> KX-9A.pdf <http://www.geyer-electronic.de/uploads/tx_userartikelfrequenz/GEYER-KX-9A.pdf> KX-9B.pdf <http://www.geyer-electronic.de/uploads/tx_userartikelfrequenz/GEYER-KX-9B.pdf> KX-12A.pdf <http://www.geyer-electronic.de/uploads/tx_userartikelfrequenz/GEYER-KX-12A.pdf> KX-12B.pdf <http://www.geyer-electronic.de/uploads/tx_userartikelfrequenz/GEYER-KX-12B.pdf> KX-13.pdf <http://www.geyer-electronic.de/uploads/tx_userartikelfrequenz/GEYER-KX-13.pdf> KX-20.pdf <http://www.geyer-electronic.de/uploads/tx_userartikelfrequenz/GEYER-KX-20.pdf> KX-K.pdf <http://www.geyer-electronic.de/uploads/tx_userartikelfrequenz/GEYER-KX-K.pdf> KX-KS.pdf <http://www.geyer-electronic.de/uploads/tx_userartikelfrequenz/GEYER-KX-KS.pdf> <http://www.geyer-electronic.de/fileadmin/template/img/logo-geyer-electronic.png> Details see: http://www.geyer-electronic.de/Frequenz-Produkte.9.0.html Created 2016-06-07, Hans Locher 2016 (C) Geyer Quartz Technology KX4,KX5,KX6,KX7,KX9A,KX9B,KX12A,KX12B,KX13,KX20,KXK,KXKS;1612;2016;2520;3225;5032;6035;7050;11655;12345;1,6x1,2;2,0x1,6;2,5x2,0;3,2x2,5;5,0x3,2;6,0x3,5;7,0x5,0;11,6x5,5;12,3x4,5;12,3x4,5;1.6x1.2;2.0x1.6;2.5x2.0;3.2x2.5;5.0x3.2;6.0x3.5;7.0x5.0;11.6x5.5;12.3x4.5;12.3x4.5;
R20 R21 = rcl:R-US_: RESISTOR, American symbol; SPICEPREFIX: R
T1-T5 = transistor:*-PNP-: PNP Transistror
U2 = MT3608:MT3608: High Efficiency 1.2MHz 2A Step Up Converter; AVAILABILITY: Unavailable; DESCRIPTION: High Efficiency 1.2MHz 2A Step Up Converter; MF: Aerosemi Technology Co., Ltd; MP: MT3608; PACKAGE: Package; PRICE: None
X1 = IQD-Frequency-Products:CRYSTALS-NOGND: CRYSTALS CAN NOT GROUNDED
X6 = con-usb:USB: USB Connectors
X7 = power-jack:DC: 5mm x 2.1mm jack
X8 = con-berg:PN61729-S: BERG USB connector; OC_FARNELL: unknown; OC_NEWARK: unknown